# EAGLE design 04C-001A (EAGLE 6.3)
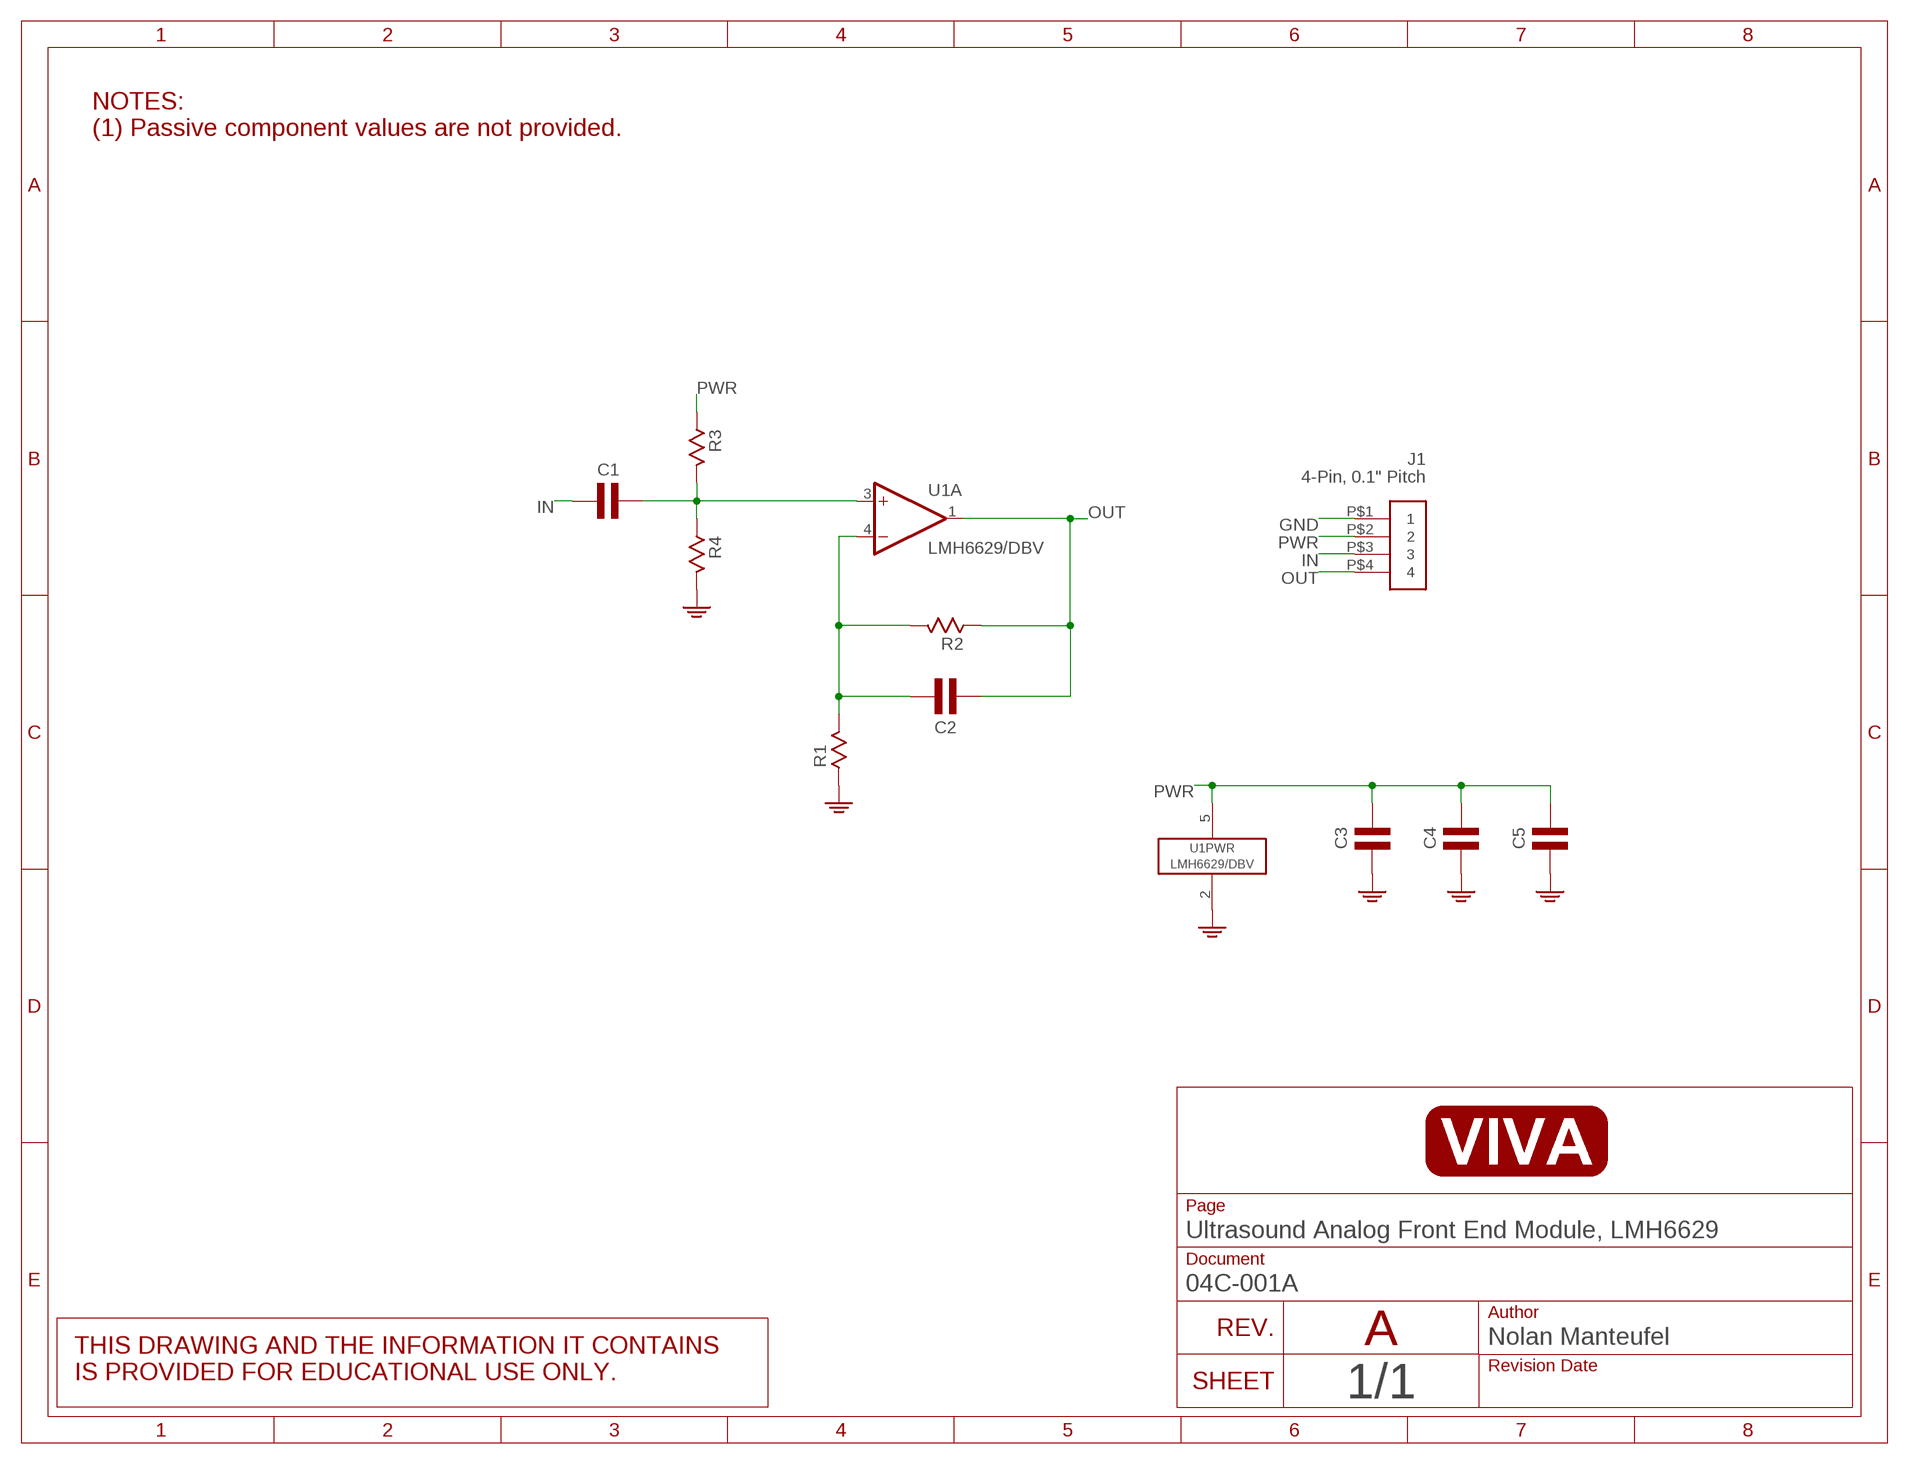
[diagram p0: schematic, sheet 1]

## Parts
C1  C0805  [C0805]
C2  C0805  [C0805]
C3  C0805  [C0805]
C4  C0805  [C0805]
C5  C0805  [C0805]
J1  4-Pin, 0.1" Pitch  PINS_4SILK  [PCB_4]
R1  R0805  [R0805]
R2  R0805  [R0805]
R3  R0805  [R0805]
R4  R0805  [R0805]
U1  LMH6629/DBV  [SOT23-5]

## Nets
GND: C3.1 C4.1 C5.1 J1.P$1 R1.1 R4.2 U1.2(PWR:V-)
IN: C1.1 J1.P$3
N$1: C1.2 R3.2 R4.1 U1.3(A:+IN)
N$2: C2.2 R1.2 R2.2 U1.4(A:-IN)
OUT: C2.1 J1.P$4 R2.1 U1.1(A:OUT)
PWR: C3.2 C4.2 C5.2 J1.P$2 R3.1 U1.5(PWR:V+)

## Notes on the sheet
- NOTES:
  (1) Passive component values are not provided.
- A

## Library data of the parts
C1-C5 = nolan-utsa:C
J1 = nolan-utsa:PINS_4
R1-R4 = nolan-utsa:R
U1 = nolan-utsa:LMH6629

## Board
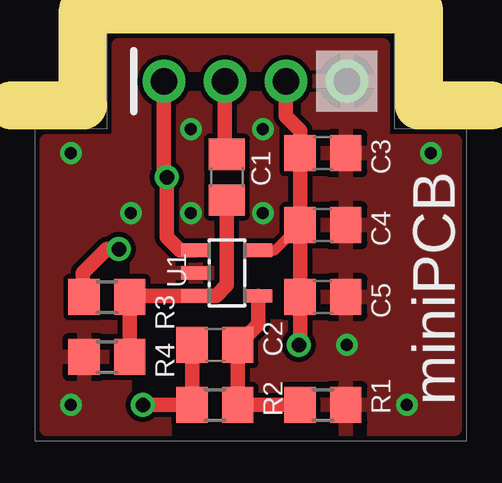
[diagram p1: board, top side]
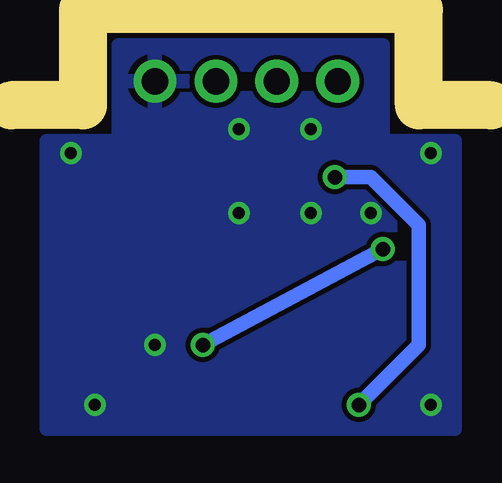
[diagram p2: board, bottom side, seen from below]

No outline drawn. Coordinates in mm, seen from the top.
Copper layers (1*16): Top 0.035mm / dielectric 1.5mm / Bottom 0.035mm
Design rules "default": minimum track width 10mil, minimum drill 24mil, track to track 8mil, track to pad 8mil, pad to pad 8mil, via to via 8mil, smd to smd 8mil, copper to edge 40mil, drill to drill 8mil, minimum pad ring 10mil, minimum via ring 8mil, stop-mask expansion 4mil, vias tented up to drill 0mil, thermal gap 10mil
Milling: 5 lines

### Footprints (pad centres in the part's own frame; a part is rotated, then mirrored left to right if it is on the bottom)
C0805 = smd 1.3 x 1.5: 1 -0.95,0; 2 0.95,0
PCB_4 = drill 1.1 pad 1.778: P$1 0,0; P$2 0,-2.54; P$3 0,-5.08; P$4 0,-7.62
R0805 = smd 1.3 x 1.5: 1 -0.95,0; 2 0.95,0
SOT23-5 = smd 0.55 x 1.2: 1 -0.95,-1.3; 2 0,-1.3; 3 0.95,-1.3; 4 0.95,1.3; 5 -0.95,1.3

### Placement (x,y rotation side)
C1  5,14 270 top
C2  4.5,7 0 top
C3  9,15 180 top
C4  9,12 180 top
C5  9,9 180 top
J1  10,18 270 top
R1  9,4.5 180 top
R2  4.5,4.5 0 top
R3  0,9 0 top
R4  0,6.5 180 top
U1  5,10 270 top

### Tracks (layer width: path | path; a pad name or v marks a point on that pad's centre or on a via)
GND  (via drill 0.5)
  other vias: -1.5,15 -1.5,4.5 12.5,4.5 10,7 6.5,16 3.5,16 13.5,15 3.5,12.5 6.5,12.5 1,12.5
  pour Bottom: -2.5,3.5 14.5,3.5 14.5,15.5 11.5,15.5 11.5,19.5 0.5,19.5 0.5,15.5 -2.5,15.5
  pour Top: -2.5,3.5 14.5,3.5 14.5,15.5 11.5,15.5 11.5,19.5 0.5,19.5 0.5,15.5 -2.5,15.5
IN
  Top 0.61: J1.P$3 4.92,15.03 C1.1
N$1
  Top 0.61: R4.1 R3.2 1.05,9.1 1.1,9.05 U1.3 4.55,9.05 5,9.5 C1.2
N$2
  Top 0.61: R1.2 R2.2 C2.2 6.3,7.85 U1.4
OUT  (via drill 0.6)
  Top 0.61: C2.1 R2.1 v1.5,4.5 | J1.P$4 2.38,14.12 v2.5,14 2.5,11.5 3.05,10.95 U1.1
  Bottom 0.61: v2.5,14 1,14 -1,12 -1,7 v1.5,4.5
PWR  (via drill 0.6)
  Top 0.406: U1.5 7,10.95 C4.2
  Top 0.61: J1.P$2 7.46,16.54 8.05,15.95 C3.2 C4.2 C5.2 8.05,7.05 v8,7 | R3.1 -1,9.05 -1,10 0,11 v0.5,11
  Bottom 0.61: v0.5,11 v8,7

### Text on the board
tPlace: miniPCB